# Altium schematic sheet TFT.SchDoc
size A4; SheetNumber: 4; SheetTotal: 7
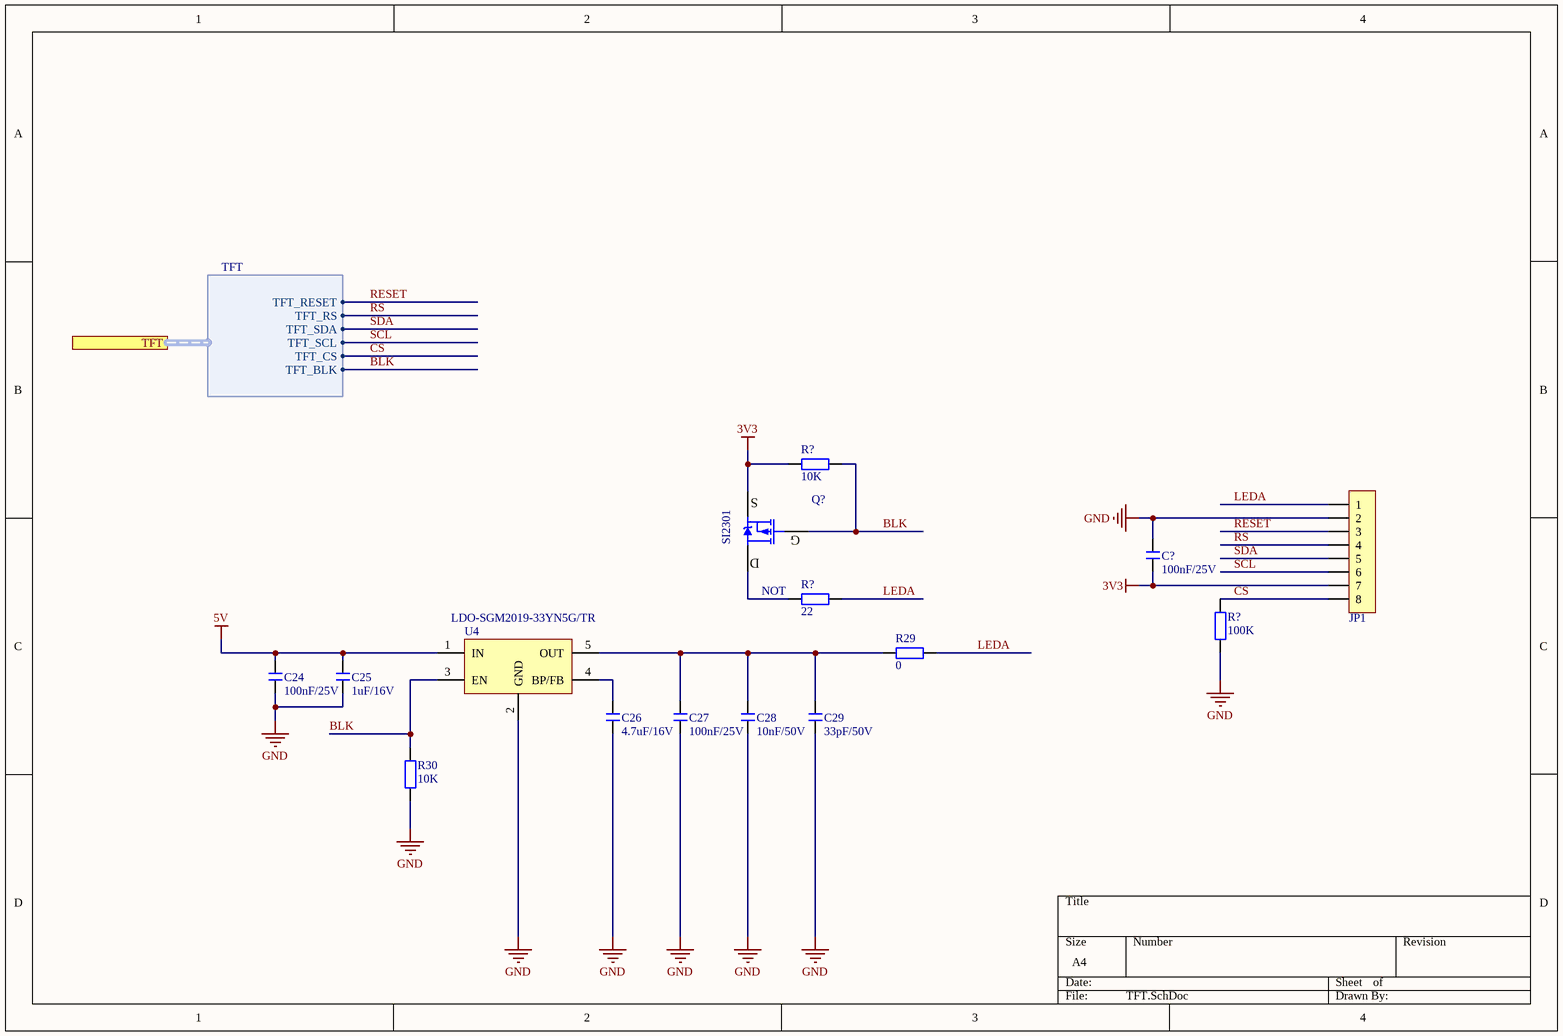
[diagram p0: TFT.SchDoc]

## Parts
(Parts that share a designator on the sheet are numbered #1, #2 ... from top to bottom, then left to right.)
C24  100nF/25V  [C 0603_L]
C25  1uF/16V  [C 0603_L]
C26  4.7uF/16V  [C 0603_L]
C27  100nF/25V  [C 0603_L]
C28  10nF/50V  [C 0402_L]
C29  33pF/50V  [C 0402_L]
C?  100nF/25V  [C 0603_L]
JP1  FPC1.0-8P  [FPC1.25A-LI-8P]  (value not drawn)
Q?  SI2301  [TO220B]
R29  0  [R 0402_L]
R30  10K  [R 0402_L]
R?#1  10K  [R 0402_L]
R?#2  22  [R 0402_L]
R?#3  100K  [R 0402_L]
U4  LDO-SGM2019-33YN5G/TR  [SC70-5]

## Ports
TFT (harness TFT)

## Harnesses
TFT: TFT_SDA, TFT_SCL, TFT_RESET, TFT_RS, TFT_CS, TFT_BLK

## Nets
3V3: C?.2 JP1.7 Q?.3(S) R?#1.2
5V: C24.1 C25.1 U4.1(IN)
GND: C24.2 C25.2 C26.2 C27.2 C28.2 C29.2 C?.1 JP1.2 R30.2 R?#3.2 U4.2(GND)
BLK: Q?.1(G) R30.1 R?#1.1 U4.3(EN) ; port TFT.TFT_BLK
CS: JP1.8 R?#3.1 ; port TFT.TFT_CS
LEDA: JP1.1 R29.1 R?#2.1
RESET: JP1.3 ; port TFT.TFT_RESET
RS: JP1.4 ; port TFT.TFT_RS
SCL: JP1.6 ; port TFT.TFT_SCL
SDA: JP1.5 ; port TFT.TFT_SDA
NetC26_1: C26.1 U4.4(BP/FB)
NetC27_1: C27.1 C28.1 C29.1 R29.2 U4.5(OUT)
NetQ?_2: Q?.2(D) R?#2.2

## Notes on the sheet
- (near R?#2) NOT

## Library data of the parts
C24 C27 C? = C: 贴片电容; 主类型: 电容; 值精度: ±10%; 元件封装: 0603; 具体类型: 陶瓷电容; 封装类型: 贴片; 温度漂移: X7R（15%）; 温度范围: -55°C ~ 125°C; 生产商: SAMSUNG(三星); 生产商零件编码: CL10B104KA8NNNC; 值/型号: 100nF/25V; 立创编号: C1590
C25 = C: 贴片电容; 主类型: 电容; 值精度: ±5%; 元件封装: 0603; 具体类型: 陶瓷电容; 封装类型: 贴片; 温度漂移: X7R（5%）; 温度范围: -55°C ~ 125°C; 生产商: YAGEO(国巨); 生产商零件编码: CC0603JRX7R7BB105; 值/型号: 1uF/16V; 立创编号: C519560
C26 = C: 贴片电容; 主类型: 电容; 值精度: ±10%; 元件封装: 0603; 具体类型: 陶瓷电容; 封装类型: 贴片; 温度漂移: X5R; 温度范围: -55°C ~ 85°C; 生产商: SAMSUNG(三星); 生产商零件编码: CL10A475KO8NNNC; 值/型号: 4.7uF/16V; 立创编号: C19666
C28 = C: 贴片电容 10nF/50V; 主类型: 电容; 值精度: ±5%; 元件封装: 0402; 具体类型: 陶瓷电容; 封装类型: 贴片; 温度漂移: C0G; 温度范围: -55°C ~ 125°C; 生产商: YAGEO(国巨); 生产商零件编码: CC0402JRX7R9BB103; 值/型号: 10nF/50V; 立创编号: C272878
C29 = C: 贴片电容 33pF/50V; 主类型: 电容; 值精度: ±1%; 元件封装: 0402; 具体类型: 陶瓷电容; 封装类型: 贴片; 温度漂移: C0G; 温度范围: -55°C ~ 125°C; 生产商: FH(风华); 生产商零件编码: 0402CG330F500NT; 值/型号: 33pF/50V; 立创编号: C501826
JP1 = FPC-8P: FPC连接器; 版权归属: 源创客; BOM名称: FPC连接器; 学习资源: www.ooocke.com
Q? = D15P05: P沟道场效应管; 版权归属: 源创客; BOM名称: P沟道场效应管; 学习资源: www.ooocke.com
R29 R30 R?#1 R?#2 = R: 贴片电阻 0402 1%; 主类型: 电阻; 值/型号: 100K; 元件封装: 0402; 封装类型: 贴片; 温度漂移: ±100ppm/℃; 生产商: 国巨; 生产商零件编码: RC0402FR-07100KL; 值精度: ±1%; 具体类型: 贴片电阻; 立创编号: C60491
R?#3 = R: 贴片电阻 0402 1%; 主类型: 电阻; 元件封装: 0402; 封装类型: 贴片; 温度漂移: ±100ppm/℃; 生产商: 国巨; 生产商零件编码: RC0402FR-07100KL; 值/型号: 100K; 值精度: ±1%; 具体类型: 贴片电阻; 立创编号: C60491
U4 = LDO-SGM2019-XXYN5G/TR: 主类型: 线性稳压器; 值/型号: SGM2019-3.3; 元件封装: SC-70-5; 具体类型: LDO; 封装类型: 贴片; 温度范围: -40-85; 生产商: SGMICRO(圣邦微); 生产商零件编码: SGM2019-3.3YC5G; 立创编号: C122713